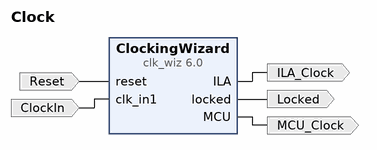
[diagram p0: block diagram of the top level]
# Vivado block design Clock, xc7z010clg400-1, Vivado 2024.1
create_bd_design Clock

create_bd_port -dir I -type clk ClockIn
set_property -dict {CONFIG.ASSOCIATED_RESET Reset CONFIG.FREQ_HZ 125000000} [get_bd_ports ClockIn]
create_bd_port -dir O -type clk MCU_Clock
create_bd_port -dir I -type rst Reset
set_property -dict {CONFIG.POLARITY ACTIVE_HIGH} [get_bd_ports Reset]
create_bd_port -dir O Locked
create_bd_port -dir O -type clk ILA_Clock

create_bd_cell -type ip -vlnv xilinx.com:ip:clk_wiz:6.0 ClockingWizard
set_property -dict [list \
  CONFIG.CLKIN1_JITTER_PS 80.0 \
  CONFIG.CLKOUT1_JITTER 180.478 \
  CONFIG.CLKOUT1_PHASE_ERROR 96.948 \
  CONFIG.CLKOUT1_REQUESTED_OUT_FREQ 16 \
  CONFIG.CLKOUT2_JITTER 124.615 \
  CONFIG.CLKOUT2_PHASE_ERROR 96.948 \
  CONFIG.CLKOUT2_USED true \
  CONFIG.CLK_OUT1_PORT MCU \
  CONFIG.CLK_OUT2_PORT ILA \
  CONFIG.MMCM_CLKFBOUT_MULT_F 8.000 \
  CONFIG.MMCM_CLKIN1_PERIOD 8.000 \
  CONFIG.MMCM_CLKOUT0_DIVIDE_F 62.500 \
  CONFIG.MMCM_CLKOUT1_DIVIDE 10 \
  CONFIG.NUM_OUT_CLKS 2 \
  CONFIG.PRIM_IN_FREQ 125 \
  CONFIG.RESET_PORT reset \
  CONFIG.RESET_TYPE ACTIVE_HIGH \
  CONFIG.USE_LOCKED true \
  CONFIG.USE_RESET true \
] [get_bd_cells ClockingWizard]

# ---- connections ----

connect_bd_net [get_bd_pins ClockingWizard/ILA] [get_bd_ports ILA_Clock]
connect_bd_net [get_bd_pins ClockingWizard/MCU] [get_bd_ports MCU_Clock]
connect_bd_net [get_bd_pins ClockingWizard/locked] [get_bd_ports Locked]
connect_bd_net [get_bd_ports Reset] [get_bd_pins ClockingWizard/reset]
connect_bd_net -net clk_100MHz_1 [get_bd_ports ClockIn] [get_bd_pins ClockingWizard/clk_in1]

validate_bd_design
save_bd_design
